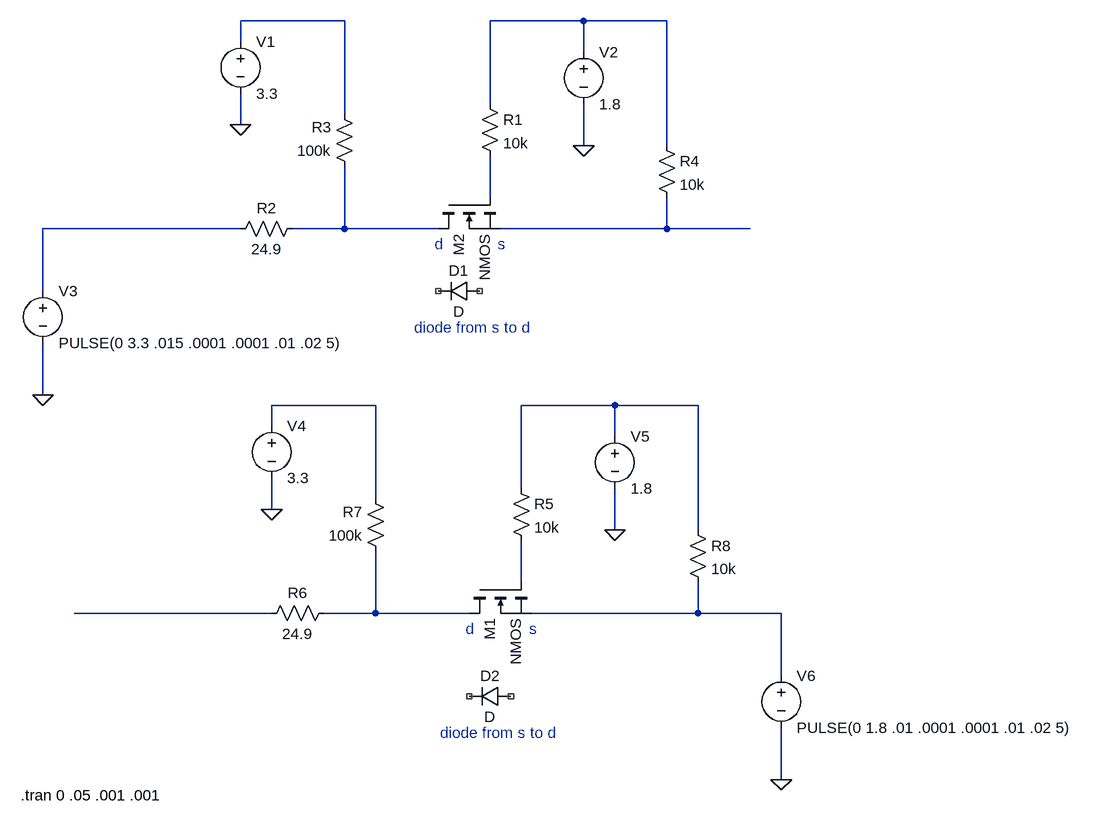
[diagram p0: schematic Mosfet Level Shifter.asc]
Mosfet Level Shifter.asc, the LTspice schematic file:
Version 4
SHEET 1 1244 968
WIRE 96 -240 -64 -240
WIRE 464 -240 320 -240
WIRE 592 -240 464 -240
WIRE -64 -208 -64 -240
WIRE 464 -192 464 -240
WIRE 320 -112 320 -240
WIRE 96 -96 96 -240
WIRE -64 -80 -64 -128
WIRE 464 -48 464 -112
WIRE 592 -48 592 -240
WIRE 320 32 320 -32
WIRE -64 80 -368 80
WIRE 96 80 96 -16
WIRE 96 80 16 80
WIRE 240 80 96 80
WIRE 592 80 592 32
WIRE 592 80 336 80
WIRE 720 80 592 80
WIRE -368 176 -368 80
WIRE -368 336 -368 256
WIRE 144 352 -16 352
WIRE 512 352 368 352
WIRE 640 352 512 352
WIRE -16 384 -16 352
WIRE 512 400 512 352
WIRE 368 480 368 352
WIRE 144 496 144 352
WIRE -16 512 -16 464
WIRE 512 544 512 480
WIRE 640 544 640 352
WIRE 368 624 368 560
WIRE -16 672 -320 672
WIRE 144 672 144 576
WIRE 144 672 64 672
WIRE 288 672 144 672
WIRE 640 672 640 624
WIRE 640 672 384 672
WIRE 768 672 640 672
WIRE 768 768 768 672
WIRE 768 928 768 848
FLAG -64 -80 0
FLAG 464 -48 0
FLAG -368 336 0
FLAG -16 512 0
FLAG 512 544 0
FLAG 768 928 0
SYMBOL nmos 240 32 M90
SYMATTR InstName M2
SYMBOL res 304 -128 R0
SYMATTR InstName R1
SYMATTR Value 10k
SYMBOL res 32 64 R90
WINDOW 0 0 56 VBottom 2
WINDOW 3 32 56 VTop 2
SYMATTR InstName R2
SYMATTR Value 24.9
SYMBOL res 112 0 R180
WINDOW 0 36 76 Left 2
WINDOW 3 36 40 Left 2
SYMATTR InstName R3
SYMATTR Value 100k
SYMBOL voltage -64 -224 R0
WINDOW 123 0 0 Left 0
WINDOW 39 0 0 Left 0
SYMATTR InstName V1
SYMATTR Value 3.3
SYMBOL voltage 464 -208 R0
WINDOW 123 0 0 Left 0
WINDOW 39 0 0 Left 0
SYMATTR InstName V2
SYMATTR Value 1.8
SYMBOL res 576 -64 R0
SYMATTR InstName R4
SYMATTR Value 10k
SYMBOL voltage -368 160 R0
WINDOW 123 0 0 Left 0
WINDOW 39 0 0 Left 0
SYMATTR InstName V3
SYMATTR Value PULSE(0 3.3 .015 .0001 .0001 .01 .02 5)
SYMBOL nmos 288 624 M90
SYMATTR InstName M1
SYMBOL res 352 464 R0
SYMATTR InstName R5
SYMATTR Value 10k
SYMBOL res 80 656 R90
WINDOW 0 0 56 VBottom 2
WINDOW 3 32 56 VTop 2
SYMATTR InstName R6
SYMATTR Value 24.9
SYMBOL res 160 592 R180
WINDOW 0 36 76 Left 2
WINDOW 3 36 40 Left 2
SYMATTR InstName R7
SYMATTR Value 100k
SYMBOL voltage -16 368 R0
WINDOW 123 0 0 Left 0
WINDOW 39 0 0 Left 0
SYMATTR InstName V4
SYMATTR Value 3.3
SYMBOL voltage 512 384 R0
WINDOW 123 0 0 Left 0
WINDOW 39 0 0 Left 0
SYMATTR InstName V5
SYMATTR Value 1.8
SYMBOL res 624 528 R0
SYMATTR InstName R8
SYMATTR Value 10k
SYMBOL voltage 768 752 R0
WINDOW 123 0 0 Left 0
WINDOW 39 0 0 Left 0
SYMATTR InstName V6
SYMATTR Value PULSE(0 1.8 .01 .0001 .0001 .01 .02 5)
SYMBOL diode 304 160 R90
WINDOW 0 0 32 VBottom 2
WINDOW 3 32 32 VTop 2
SYMATTR InstName D1
SYMBOL diode 352 784 R90
WINDOW 0 0 32 VBottom 2
WINDOW 3 32 32 VTop 2
SYMATTR InstName D2
TEXT 344 104 Right 2 ;s
TEXT 248 104 Right 2 ;d
TEXT 384 232 Right 2 ;diode from s to d
TEXT 392 696 Right 2 ;s
TEXT 296 696 Right 2 ;d
TEXT 424 856 Right 2 ;diode from s to d
TEXT -402 952 Left 2 !.tran 0 .05 .001 .001

The netlist it stands for:
* Mosfet Level Shifter.asc
M2 N005 N003 N006 N006 NMOS
R1 N002 N003 10k
R2 N005 N004 24.9
R3 N005 N001 100k
V1 N001 0 3.3
V2 N002 0 1.8
R4 N002 N006 10k
V3 N004 0 PULSE(0 3.3 .015 .0001 .0001 .01 .02 5)
M1 N011 N009 N012 N012 NMOS
R5 N008 N009 10k
R6 N011 N010 24.9
R7 N011 N007 100k
V4 N007 0 3.3
V5 N008 0 1.8
R8 N008 N012 10k
V6 N012 0 PULSE(0 1.8 .01 .0001 .0001 .01 .02 5)
D1 NC_01 NC_02 D
D2 NC_03 NC_04 D
.model D D
.lib standard.dio
.model NMOS NMOS
.model PMOS PMOS
.lib standard.mos
* s
* d
* diode from s to d
* s
* d
* diode from s to d
.tran 0 .05 .001 .001
.backanno
.end